# EAGLE design The Yowler v9 (EAGLE 7.3.0)
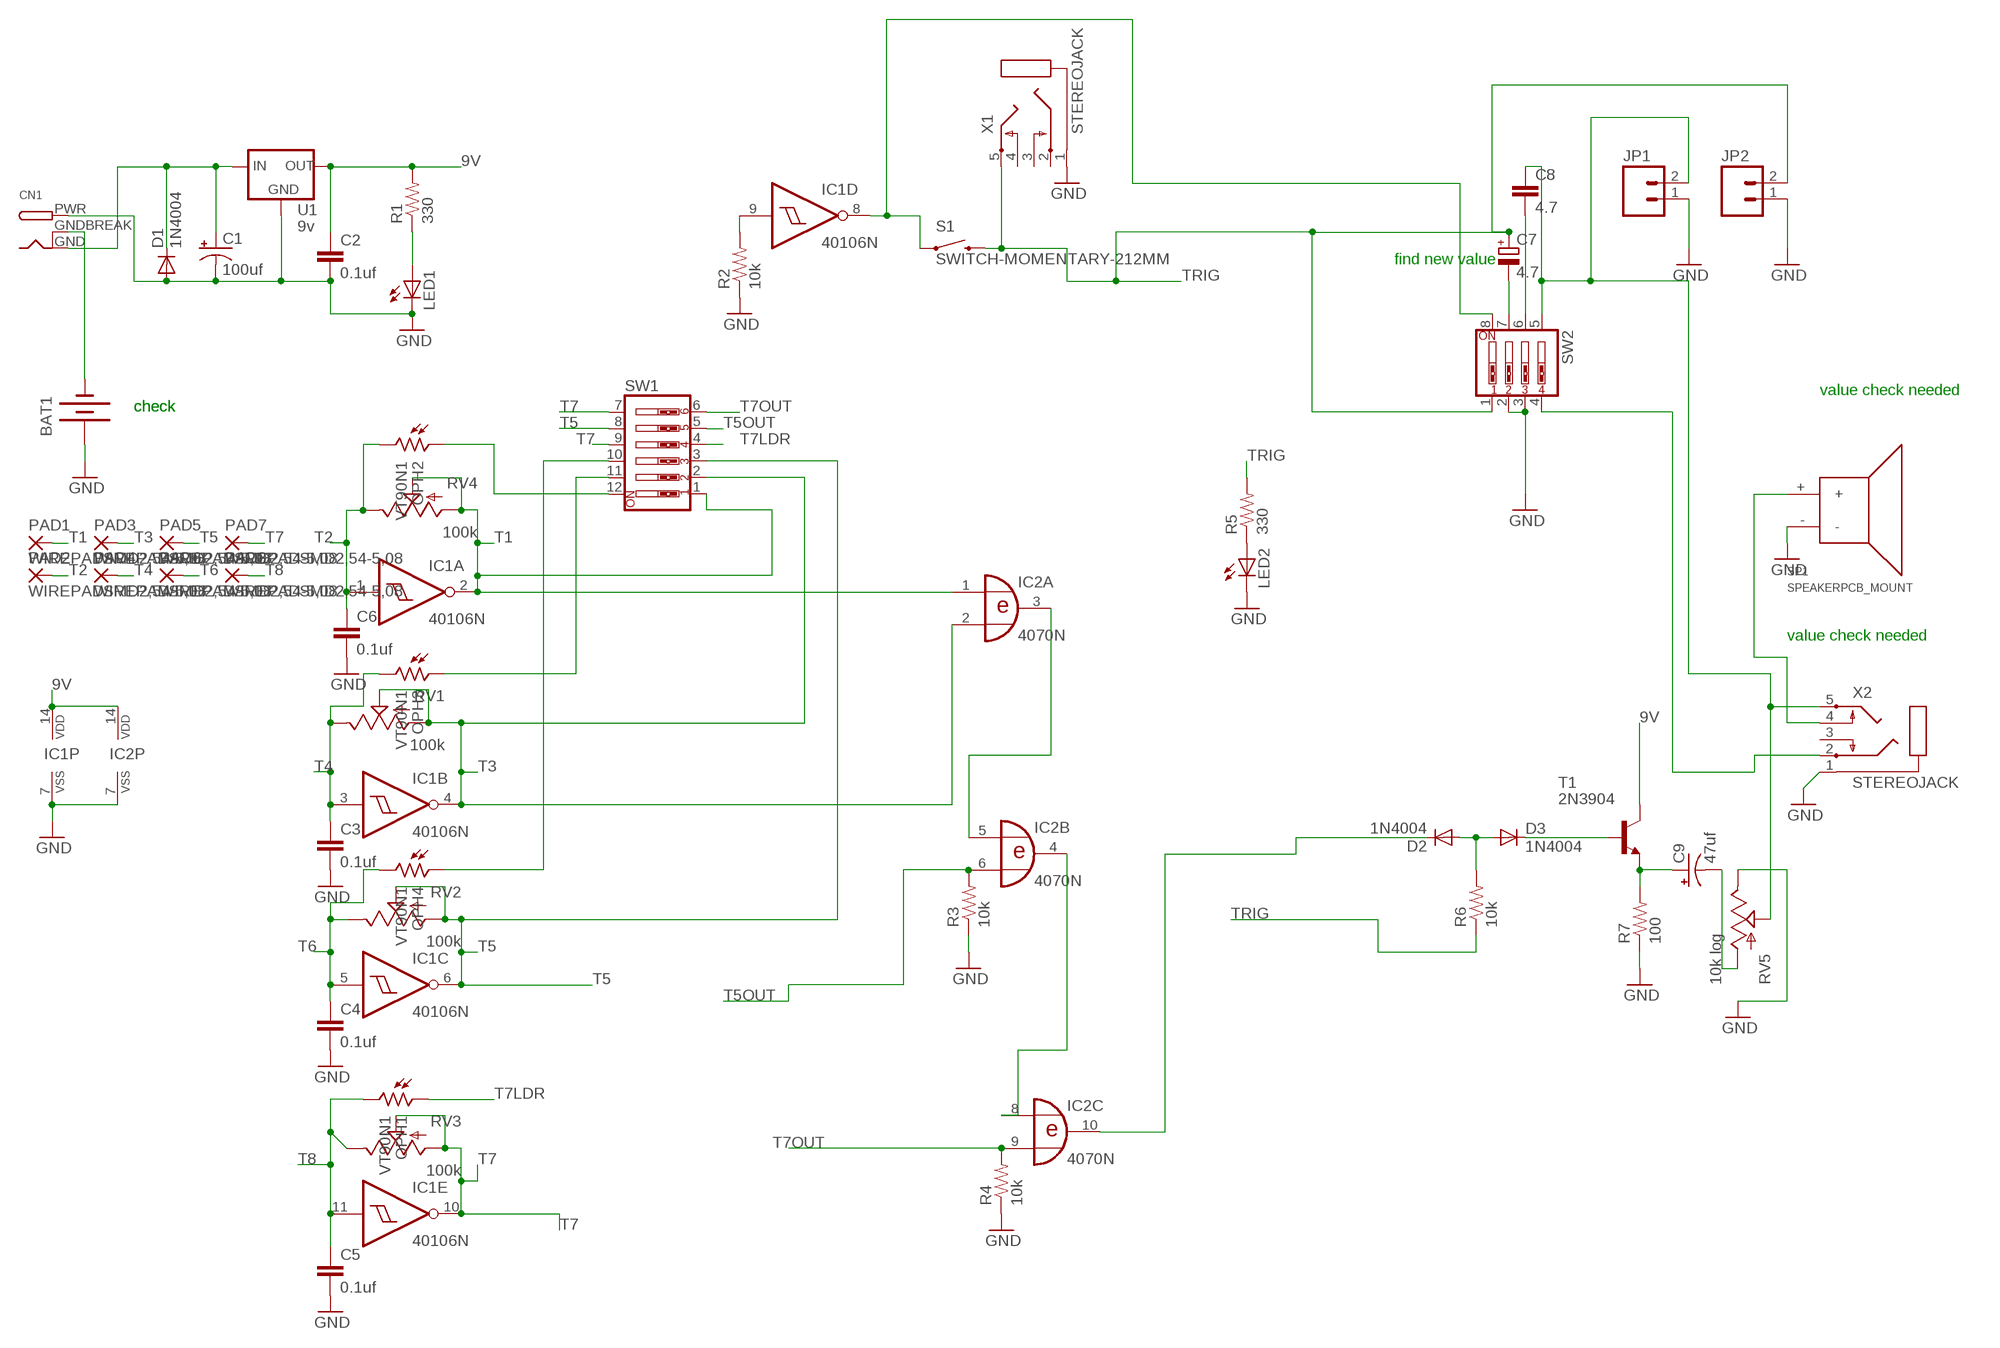
[diagram p0: schematic, sheet 1]

## Parts
BAT1  BATTERY9V  [BATTCON_9V]
C1  100uf  CPOL-USE5-6  [E5-6]
C2  0.1uf  CAPPTH1  [CAP-PTH-5MM]
C3  0.1uf  CAPPTH1  [CAP-PTH-5MM]
C4  0.1uf  CAPPTH1  [CAP-PTH-5MM]
C5  0.1uf  CAPPTH1  [CAP-PTH-5MM]
C6  0.1uf  CAPPTH1  [CAP-PTH-5MM]
C7  4.7  CPOL-EUE5-5  [E5-5]
C8  4.7  C-EU050-030X075  [C050-030X075]
C9  47uf  CAP_POLPTH2  [CPOL-RADIAL-10UF-25V]
CN1  DCBARRELPTH  [DCJACK_2MM_PTH]
D1  1N4004  [DO41-10]
D2  1N4004  [DO41-10]
D3  1N4004  [DO41-10]
IC1  40106N  [DIL14]
IC2  4070N  [DIL14]
JP1  M02POGO_PIN_HOLES_ONLY  [1X02_PP_HOLES_ONLY]
JP2  M02POGO_PIN_HOLES_ONLY  [1X02_PP_HOLES_ONLY]
LED1  LED3MM  [LED3MM]
LED2  LED3MM  [LED3MM]
OPH1  VT90N1  [VT900]
OPH2  VT90N1  [VT900]
OPH3  VT90N1  [VT900]
OPH4  VT90N1  [VT900]
PAD1  WIREPADSMD2,54-5,08  [SMD2,54-5,08]
PAD2  WIREPADSMD2,54-5,08  [SMD2,54-5,08]
PAD3  WIREPADSMD2,54-5,08  [SMD2,54-5,08]
PAD4  WIREPADSMD2,54-5,08  [SMD2,54-5,08]
PAD5  WIREPADSMD2,54-5,08  [SMD2,54-5,08]
PAD6  WIREPADSMD2,54-5,08  [SMD2,54-5,08]
PAD7  WIREPADSMD2,54-5,08  [SMD2,54-5,08]
PAD8  WIREPADSMD2,54-5,08  [SMD2,54-5,08]
R1  330  RESISTORPTH-1/4W  [AXIAL-0.4]
R2  10k  RESISTORPTH-1/4W  [AXIAL-0.4]
R3  10k  RESISTORPTH-1/4W  [AXIAL-0.4]
R4  10k  RESISTORPTH-1/4W  [AXIAL-0.4]
R5  330  RESISTORPTH-1/4W  [AXIAL-0.4]
R6  10k  RESISTORPTH-1/4W  [AXIAL-0.4]
R7  100  RESISTORPTH-1/4W  [AXIAL-0.4]
RV1  100k  POT  [ALPS_POT]
RV2  100k  POT  [ALPS_POT]
RV3  100k  POT  [ALPS_POT]
RV4  100k  POT  [ALPS_POT]
RV5  10k log  POT  [ALPS_POT]
S1  SWITCH-MOMENTARY-212MM  [TACTILE-PTH-12MM]
SP1  SPEAKERPCB_MOUNT  [PCB_MOUNT_SPEAKER]
SW1  SW_DIP-6  [EDG-06]
SW2  SW_DIP-4  [EDG-04]
T1  2N3904  [TO92]
U1  9v  V_REG_78XX-TO-220  [TO-220-ALT]
X1  STEREOJACK  [STX3100]
X2  STEREOJACK  [STX3100]

## Nets
9V: C2.1 IC1.14(P:VDD) IC2.14(P:VDD) R1.P$2 T1.1(C) U1.OUT
AUDIO: SW2.4 X2.2
GND: BAT1.+ C1.- C2.2 C3.2 C4.2 C5.2 C6.2 CN1.PWR D1.A IC1.7(P:VSS) IC2.7(P:VSS) JP1.1 JP2.1 LED1.K(C) LED2.K(C) R2.P$1 R3.P$1 R4.P$1 R7.P$1 RV5.P$1(E) SP1.- SW2.2 SW2.3 U1.GND X1.1 X2.1
N$1: LED2.A R5.P$1
N$2: IC1.9(D:I) R2.P$2
N$3: OPH4.1 SW1.10
N$4: IC2.4(B:O) IC2.8(C:I0)
N$5: C9.2(-) RV5.P$3(A)
N$6: C1.+ CN1.GND D1.C U1.IN
N$7: LED1.A R1.P$1
N$11: IC2.3(A:O) IC2.5(B:I0)
N$12: OPH2.1 SW1.12
N$13: IC1.8(D:O) S1.1 SW2.8
N$14: OPH3.1 SW1.11
N$16: BAT1.- CN1.GNDBREAK
N$17: C8.2 SW2.6
N$18: D2.C IC2.10(C:O)
N$19: D2.A D3.A R6.P$2
N$20: C7.- SW2.7
N$22: D3.C T1.2(B)
N$23: C9.1(+) R7.P$2 T1.3(E)
N$25: C8.1 JP1.2 RV5.P$2(S) SW2.5 X2.5
N$26: SP1.+ X2.4
T1: IC1.2(A:O) IC2.1(A:I0) PAD1.1(P) RV4.P$2(S) RV4.P$3(A) SW1.1
T2: C6.1 IC1.1(A:I) OPH2.2 PAD2.1(P) RV4.P$1(E)
T3: IC1.4(B:O) IC2.2(A:I1) PAD3.1(P) RV1.P$2(S) RV1.P$3(A) SW1.2
T4: C3.1 IC1.3(B:I) OPH3.2 PAD4.1(P) RV1.P$1(E)
T5: IC1.6(C:O) PAD5.1(P) RV2.P$2(S) RV2.P$3(A) SW1.3 SW1.8
T5OUT: IC2.6(B:I1) R3.P$2 SW1.5
T6: C4.1 IC1.5(C:I) OPH4.2 PAD6.1(P) RV2.P$1(E)
T7: IC1.10(E:O) PAD7.1(P) RV3.P$2(S) RV3.P$3(A) SW1.7 SW1.9
T7LDR: OPH1.1 SW1.4
T7OUT: IC2.9(C:I1) R4.P$2 SW1.6
T8: C5.1 IC1.11(E:I) OPH1.2 PAD8.1(P) RV3.P$1(E)
TRIG: C7.+ JP2.2 R5.P$2 R6.P$1 S1.3 SW2.1 X1.5
Unconnected: IC1.12(F:O) IC1.13(F:I) IC2.11(D:O) IC2.12(D:I0) IC2.13(D:I1) X1.2 X1.3 X1.4 X2.3

## Notes on the sheet
- find new value
- value check needed
- check | check
- value check needed

## Library data of the parts
BAT1 = SparkFun-Electromechanical:BATTERY: Battery Holders Various common sizes : AA, AAA, 18650 (PRT-12895), 20mm coin cell and 12mm coin cell. 20MM_4LEGS, BATT-10373
C1 = adafruit:CPOL-US: POLARIZED CAPACITOR, American symbol
C2-C6 = SparkFun-Passives:CAP: Capacitor Standard 0603 ceramic capacitor, and 0.1" leaded capacitor.
C7 = resistor:CPOL-EU: POLARIZED CAPACITOR, European symbol
C8 = resistor:C-EU: CAPACITOR, European symbol
C9 = SparkFun-Capacitors:CAP_POL: Capacitor Polarized These are standard SMD and PTH capacitors. Normally 10uF, 47uF, and 100uF in electrolytic and tantalum varieties. Always verify the external diameter of the through hole cap, it varies with capacity, voltage, and manufacturer. The EIA devices should be standard.
CN1 = adafruit:DCBARREL: 2.0mm DC Barrel Jack DCJACK_2MM_PTH - Through Hole Jack (4UConnector: 05537)
D1-D3 = adafruit:1N4004: DIODE General purpose 1N400x type rectifier (With bigger pads) http://www.ladyada.net/library/pcb/eaglelibrary.html
IC1 = 40xx:40106: Hex SCHMITT TRIGGER
IC2 = 40xx:4070: Quad 2-input XOR
JP1 JP2 = SparkFun-Connectors:M02: Standard 2-pin 0.1" header. Use with - straight break away headers ( PRT-00116) - right angle break away headers (PRT-00553) - swiss pins (PRT-00743) - machine pins (PRT-00117) - female headers (PRT-00115) Molex polarized connector foot print use with: PRT-08233 with associated crimp pins and housings. 2.54_SCREWTERM for use with PRT-10571. 3.5mm Screw Terminal footprints for PRT-08084 5mm Screw Terminal footprints for use with PRT-08432
LED1 LED2 = adafruit:LED: LED OSRAM: - CHIPLED LG R971, LG N971, LY N971, LG Q971, LY Q971, LO R971, LY R971 LH N974, LH R974 LS Q976, LO Q976, LY Q976 LO Q996 - Hyper CHIPLED LW Q18S LB Q993, LB Q99A, LB R99A - SideLED LS A670, LO A670, LY A670, LG A670, LP A670 LB A673, LV A673, LT A673, LW A673 LH A674 LY A675 LS A676, LA A676, LO A676, LY A676, LW A676 LS A679, LY A679, LG A679 - Hyper Micro SIDELED® LS Y876, LA Y876, LO Y876, LY Y876 LT Y87S - SmartLED LW L88C, LW L88S LB L89C, LB L89S, LG L890 LS L89K, LO L89K, LY L89K LS L896, LA L896, LO L896, LY L896 - TOPLED LS T670, LO T670, LY T670, LG T670, LP T670 LSG T670, LSP T670, LSY T670, LOP T670, LYG T670 LG T671, LOG T671, LSG T671 LB T673, LV T673, LT T673, LW T673 LH T674 LS T676, LA T676, LO T676, LY T676, LB T676, LH T676, LSB T676, LW T676 LB T67C, LV T67C, LT T67C, LS T67K, LO T67K, LY T67K, LW E67C LS E67B, LA E67B, LO E67B, LY E67B, LB E67C, LV E67C, LT E67C LW T67C LS T679, LY T679, LG T679 LS T770, LO T770, LY T770, LG T770, LP T770 LB T773, LV T773, LT T773, LW T773 LH T774 LS E675, LA E675, LY E675, LS T675 LS T776, LA T776, LO T776, LY T776, LB T776 LHGB T686 LT T68C, LB T68C - Hyper Mini TOPLED® LB M676 - Mini TOPLED Santana® LG M470 LS M47K, LO M47K, LY M47K Source: http://www.osram.convergy.de/
OPH1-OPH4 = photo-elements:VT9: Photoconductive Cell VT900 Series Source: http://optoelectronics.perkinelmer.com/content/Datasheets/DTS_vt900seriesdatasheet.pdf
PAD1-PAD8 = wirepad:WIREPAD: Wire PAD connect wire on PCB
R1-R7 = SparkFun-Passives:RESISTOR: Resistor Basic schematic elements and footprints for 0603, 1206, and PTH resistors.
RV1-RV5 = SparkFun-Electromechanical:POT; PROD_ID: RES-09177
S1 = SparkFun-Electromechanical:SWITCH-MOMENTARY-2: Various NO switches- pushbuttons, reed, etc; PROD_ID: SWCH-09185
SP1 = SparkFun-Electromechanical:SPEAKER: General speakers.; MFG: SANCO; PROD_#: NA; SKU: COM-11089; SPARKLE_ID: 6504
SW1 = special:SW_DIP-6: DIP SWITCH
SW2 = special:SW_DIP-4: DIP SWITCH
T1 = transistor:2N3904: NPN TRANSISTOR
U1 = SparkFun-PowerIC:V_REG_78XX: Voltage Regulator Standard 78xx regulator. IGO (Input Ground Output). Spark Fun Electronics SKU : COM-00107; PROD_ID: VREG-08450; SF_ID: COM-00107
X1 X2 = adafruit:STEREOJACK: MIC/HEADPHONE JACK Stereo jack with two switches. Kycon STX3100, CUI SJ1-3555NG and/or 4UCon 05544

## Board
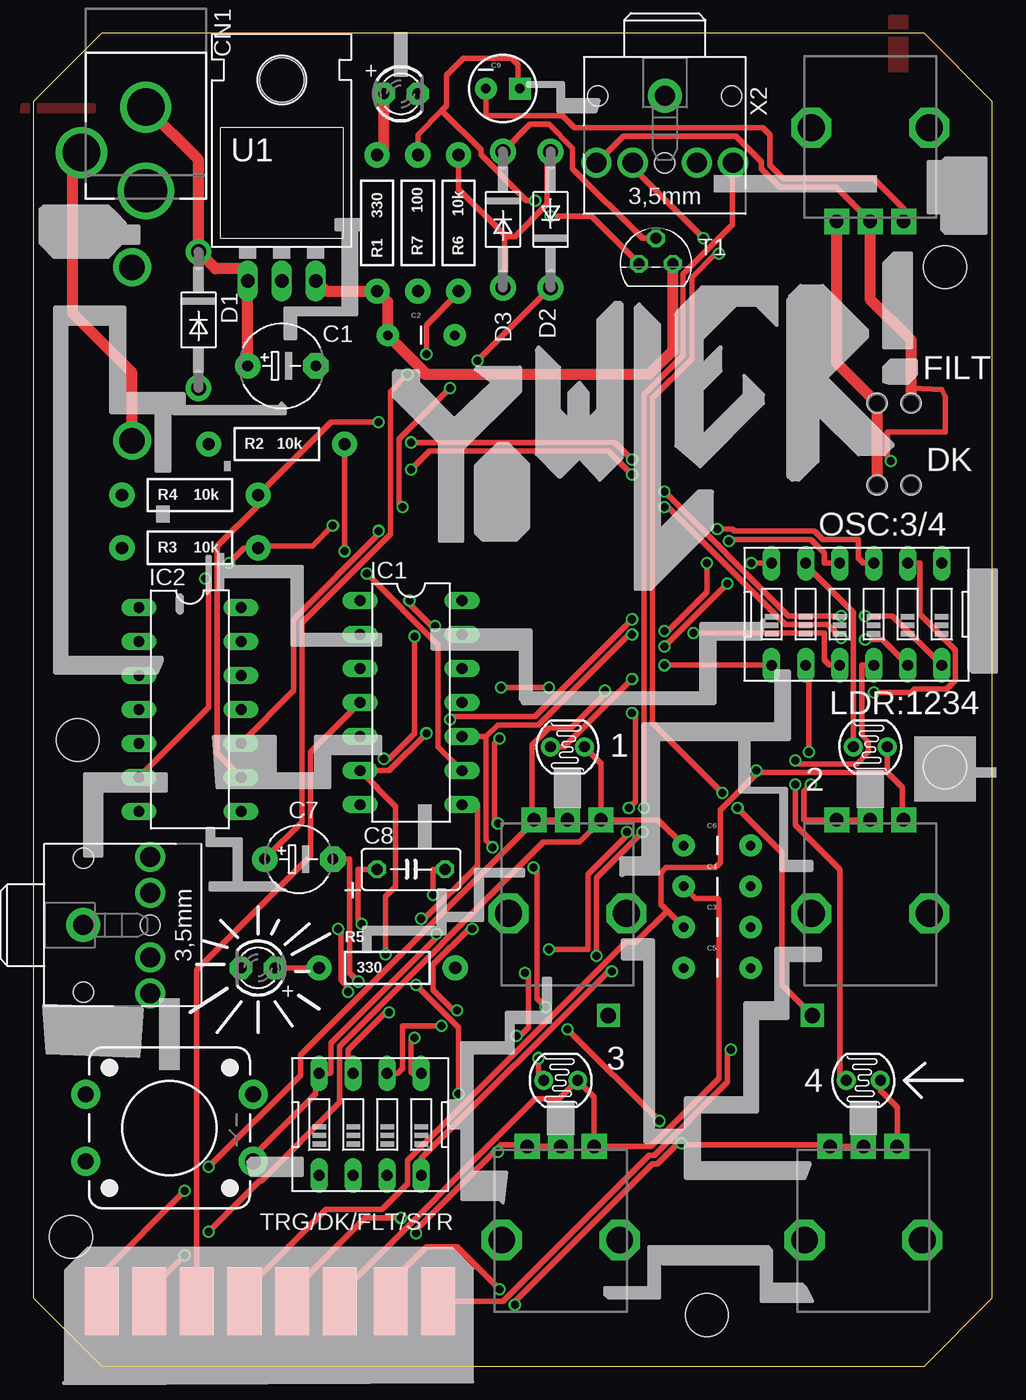
[diagram p1: board, top side]
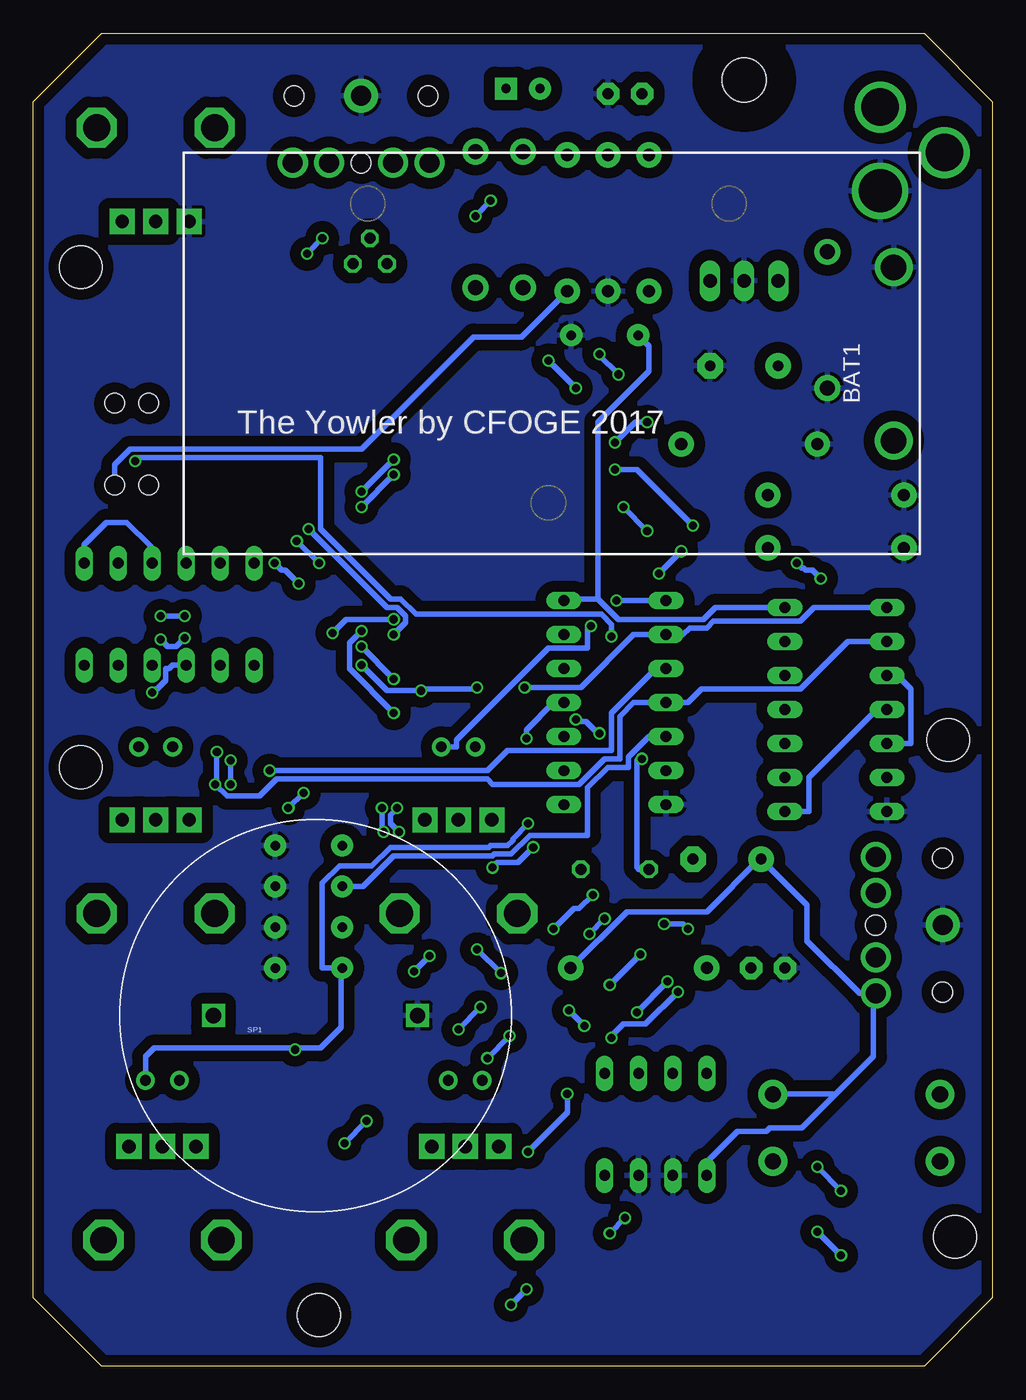
[diagram p2: board, bottom side, seen from below]

Size 71.61 x 99.49 mm. Coordinates in mm from the lower left corner, seen from the top.
Outline: 0,94.41 0,5.08 5.08,0 66.53,0 71.61,5.08 71.61,94.41 66.53,99.49 5.08,99.49 0,94.41
Copper layers (1*16): Top 0.035mm / dielectric 1.5mm / Bottom 0.035mm
Design rules "SeeedStudio_2layer_DRU_no_angle_20140221": minimum track width 6mil, minimum drill 12mil, track to track 6mil, track to pad 6mil, pad to pad 6mil, via to via 6mil, smd to smd 0mil, copper to edge 10mil, drill to drill 10mil, minimum pad ring 10mil, minimum via ring 6mil, stop-mask expansion 2mil, vias tented up to drill 100mil, thermal gap 10mil
Holes 3.2 mm at 3.3,46.74 50.29,3.81 68.07,82.04 2.79,9.65 68.07,44.7

### Footprints (pad centres in the part's own frame; a part is rotated, then mirrored left to right if it is on the bottom)
BATTCON_9V = drill 1.905: + 0,0; - 0,-12.954
E5-6 = drill 0.813 pad 1.905: + -2.54,0 | drill 0.813 pad 1.905 octagon: - 2.54,0
CAP-PTH-5MM = drill 0.7 pad 1.651: 1 -2.5,0; 2 2.5,0
E5-5 = drill 0.813 pad 1.905: + -2.54,0 | drill 0.813 pad 1.905 octagon: - 2.54,0
C050-030X075 = drill 0.813 octagon: 1 -2.54,0; 2 2.54,0
CPOL-RADIAL-10UF-25V = drill 0.7 pad 1.651 square: 1 1.27,0 | drill 0.7 pad 1.651: 2 -1.27,0
DCJACK_2MM_PTH = drill 2.8: GND 0,7.35; GNDBREAK 4.8,10.75 | drill 3.2: PWR 0,13.6
DO41-10 = drill 1.118 pad 1.93: A 5.08,0; C -5.08,0
DIL14 = drill 0.813 long: 1 -7.62,-3.81; 2 -5.08,-3.81; 3 -2.54,-3.81; 4 0,-3.81; 5 2.54,-3.81; 6 5.08,-3.81; 7 7.62,-3.81; 8 7.62,3.81; 9 5.08,3.81; 10 2.54,3.81; 11 0,3.81; 12 -2.54,3.81; 13 -5.08,3.81; 14 -7.62,3.81
1X02_PP_HOLES_ONLY = drill 0.889 pad 0.813: 1 0,0; 2 2.54,0 | hole 1.473: 0,0; 2.54,0
LED3MM = drill 0.813 pad 1.676 octagon: A -1.27,0; K 1.27,0
VT900 = drill 0.8 pad 1.4: 1 -1.27,0; 2 1.27,0
SMD2,54-5,08 = smd 2.54 x 5.08: 1 0,0
AXIAL-0.4 = drill 0.9 pad 1.88: P$1 -5.08,0; P$2 5.08,0
ALPS_POT = drill 1 pad 1.88 square: P$1 7,-2.5; P$2 7,0; P$3 7,2.5 | drill 2 octagon: P$4 0,-4.4; P$5 0,4.4
TACTILE-PTH-12MM = drill 1.2 pad 2.159: 1 6.25,-2.5; 2 -6.25,-2.5; 3 6.25,2.5; 4 -6.25,2.5
PCB_MOUNT_SPEAKER = drill 1.143 square: + -7.62,0; - 7.62,0
EDG-06 = drill 0.813 long: 1 -6.35,-3.81; 2 -3.81,-3.81; 3 -1.27,-3.81; 4 1.27,-3.81; 5 3.81,-3.81; 6 6.35,-3.81; 7 6.35,3.81; 8 3.81,3.81; 9 1.27,3.81; 10 -1.27,3.81; 11 -3.81,3.81; 12 -6.35,3.81
EDG-04 = drill 0.813 long: 1 -3.81,-3.81; 2 -1.27,-3.81; 3 1.27,-3.81; 4 3.81,-3.81; 5 3.81,3.81; 6 1.27,3.81; 7 -1.27,3.81; 8 -3.81,3.81
TO92 = drill 0.813 octagon: 1 1.27,0; 2 0,1.905; 3 -1.27,0
TO-220-ALT = drill 1.016 long: GND 0,-3.81; IN -2.54,-3.81; OUT 2.54,-3.81 | hole 3.302: 0,11.176
STX3100 = drill 1.5 pad 2.54: 1 2.7,-0.1 | drill 1.5: 2 7.7,5; 3 7.7,2.3; 4 7.7,-2.5; 5 7.7,-5.2 | hole 1.5: 2.7,4.9; 2.7,-5.1; 7.7,-0.1

### Placement (x,y rotation side)
BAT1  7.37,82.04 0 bottom
C1  18.54,74.68 0 top
C2  28.96,76.96 0 top
C3  51.05,32.77 0 top
C4  51.05,35.81 0 top
C5  51.05,29.72 0 top
C6  51.05,38.86 0 top
C7  19.81,37.85 0 top
C8  28.19,37.08 0 top
C9  35.05,95.38 0 top
CN1  8.38,101.35 180 top
D1  12.32,78.11 270 top
D2  38.61,85.6 90 top
D3  35.05,85.6 270 top
IC1  28.19,49.53 270 top
IC2  11.68,49.02 270 top
JP1  62.99,71.88 0 top
JP2  62.99,65.79 0 top
LED1  27.43,95 0 top
LED2  16.76,29.72 180 top
OPH1  61.98,21.34 0 top
OPH2  39.88,46.23 0 top
OPH3  62.48,46.23 0 top
OPH4  39.37,21.34 0 top
PAD1  5.08,4.83 180 top
PAD2  8.64,4.83 180 top
PAD3  12.19,4.83 180 top
PAD4  15.75,4.83 180 top
PAD5  19.3,4.83 180 top
PAD6  22.86,4.83 180 top
PAD7  26.67,4.83 0 top
PAD8  30.23,4.83 0 top
R1  25.65,85.34 270 top
R2  18.16,68.83 0 top
R3  11.68,61.09 0 top
R4  11.68,65.02 0 top
R5  26.42,29.72 0 top
R6  31.75,85.34 90 top
R7  28.7,85.34 90 top
RV1  62.48,33.78 90 top
RV2  39.37,9.4 90 top
RV3  61.98,9.4 90 top
RV4  39.88,33.78 90 top
RV5  62.48,92.46 270 top
S1  10.16,17.78 0 top
SP1  50.55,26.16 0 bottom
SW1  61.47,56.13 0 top
SW2  25.15,18.03 0 top
T1  46.48,82.3 0 top
U1  18.54,84.84 0 top
X1  1.02,33.02 0 top
X2  47.24,97.54 270 top

### Tracks (layer width: path | path; a pad name or v marks a point on that pad's centre or on a via)
9V
  Top 0.813: U1.OUT 21.84,80.26 R1.P$2 26.46,79.46 C2.1 29.21,74.21 29.21,74.04 45.97,74.04 47.75,75.82 T1.1
  Bottom 0.406: IC2.14 20.7,56.64 21.59,55.75 27.94,55.75 29.46,57.28 | 29.46,57.28 31.88,57.28 IC1.14 | 29.46,57.28 29.46,70.48 25.65,74.3 25.65,76.16 C2.1
AUDIO  (via drill 0.6)
  Top 0.406: SW2.4 28.96,15.49 42.93,29.46 v43.18,29.46 | v42.04,30.61 42.04,36.45 v45.47,39.88 | v45.59,41.66 45.59,72.52 48.51,75.44 48.51,81.53 52.2,85.22 52.2,89.79 X2.2
  Bottom 0.406: v42.04,30.61 v43.18,29.46 | v45.47,39.88 45.59,40.01 v45.59,41.66
GND
  Top 0.813: RV5.P$1 59.98,74.89 JP1.1 JP2.1
  pour Bottom (isolate 0.813): -3.3,102.62 74.8,102.62 74.8,-3.17 -7.49,-4.06 -3.3,102.23
N$1
  Top 0.406: LED2.A R5.P$1
N$2  (via drill 0.6)
  Top 0.406: v23.24,60.83 R2.P$2 | v24.89,59.18 30.23,53.85 30.23,46.23 IC1.9
  Bottom 0.406: v24.89,59.18 v23.24,60.83
N$3  (via drill 0.6)
  Top 0.406: SW1.10 59.05,59.94 59.05,60.71 58.04,61.72 51.82,61.72 v51.94,61.59 | v50.29,59.94 50.29,57.78 47.37,54.86 v47.12,54.86 | v44.7,48.77 44.96,48.51 44.96,42.16 v44.45,41.66 | v44.32,39.88 44.32,39.62 41.4,36.7 41.4,31.12 v38.48,31.12 | v36.7,29.34 36.96,29.08 36.96,25.27 36.32,24.64 v36.07,24.64 | v37.72,22.99 37.72,21.34 OPH4.1
  Bottom 0.406: v50.29,59.94 v51.94,61.59 | v47.12,54.86 48.01,53.98 48.01,52.07 v44.7,48.77 | v44.45,41.66 44.96,41.15 44.96,40.51 v44.32,39.88 | v36.7,29.34 v38.48,31.12 | v37.72,22.99 v36.07,24.64
N$4
  Bottom 0.406: IC2.4 8.64,49.02 13.72,43.94 13.72,41.4 IC2.8
N$5
  Top 0.406: C9.2 33.78,93.34 39.5,93.34 40.39,92.46 54.48,92.46 54.99,91.95 54.99,89.66 56.01,88.65 62.74,88.65 64.98,86.4 RV5.P$3
N$6
  Top 0.813: C1.+ U1.IN 16,81.91 13.59,81.91 D1.C 12.32,90.06 CN1.GND
N$7
  Top 0.813: R1.P$1 26.16,90.93 LED1.A
N$8
  pour Top: 64.01,100.71 64.01,96.77 65.15,96.77 65.15,100.71
N$9
  pour Top: -0.89,93.73 4.45,93.73 4.45,94.11 -0.76,94.11 -0.76,93.85
N$11
  Bottom 0.406: IC2.3 7.11,51.56 6.1,50.55 6.1,46.48 IC2.5
N$12  (via drill 0.6)
  Top 0.406: v53.59,59.94 SW1.12 | v47.12,53.72 v51.82,58.42 | v44.7,51.31 39.62,46.23 OPH2.1
  Bottom 0.406: v53.59,59.94 53.09,59.44 52.83,59.44 v51.82,58.42 | v44.7,51.31 v47.12,53.72
N$13  (via drill 0.6)
  Top 0.406: S1.1 16.41,15.65 21.08,20.32 21.08,21.59 SW2.8 22.1,21.84 22.23,21.97 22.23,24.13 30.1,32 v30.1,32.26 | v28.96,33.4 29.21,33.4 33.15,37.34 33.15,41.91 IC1.8
  Bottom 0.406: v28.96,33.4 v30.1,32.26
N$14
  Top 0.406: OPH3.1 61.21,56.26 57.66,59.82 SW1.11
N$16
  Top 0.813: BAT1.- 7.37,74.17 2.92,78.61 2.92,90.8 3.13,90.6 CN1.GNDBREAK
N$17  (via drill 0.6)
  Top 0.406: SW2.6 27.18,21.84 27.56,22.22 27.56,25.4 v30.48,25.4 | v31.62,26.54 31.37,26.54 29.84,28.07 29.84,29.97 32.51,32.64 v32.77,32.64 | v29.84,35.18 29.84,37.08 C8.2
  Bottom 0.406: v31.62,26.54 v30.48,25.4 | v32.77,32.64 31.24,34.16 30.86,34.16 v29.84,35.18
N$18  (via drill 0.6)
  Top 0.406: v33.15,75.06 D2.C | v31.12,73.03 27.3,69.22 27.3,64.39 v27.56,64.14 | v25.78,62.36 25.78,62.1 19.43,55.75 19.43,50.42 IC2.10
  Bottom 0.406: v31.12,73.03 v33.15,75.06 | v25.78,62.36 v27.56,64.14
N$19
  Top 0.406: D3.A 35.18,80.64 35.18,84.33 | 35.18,84.33 35.18,84.45 31.75,87.88 R6.P$2 | D2.A 38.35,90.42 38.35,86.74 35.94,84.33 35.18,84.33
N$20  (via drill 0.6)
  Top 0.406: SW2.7 23.5,21.84 23.5,23.62 26.29,26.42 v26.54,26.42 | v24.26,28.7 23.62,29.34 23.62,37.85 C7.-
  Bottom 0.406: v24.26,28.7 v26.54,26.42
N$22
  Top 0.406: T1.2 45.47,84.2 40.26,89.41 40.26,90.93 38.48,92.71 37.08,92.71 D3.C
N$23  (via drill 0.6)
  Top 0.406: C9.1 36.2,95.5 36.2,97.16 35.69,97.66 32.13,97.66 30.86,96.39 30.86,94.11 30.48,93.73 | 30.48,93.73 28.7,91.95 R7.P$2 | 30.48,93.73 33.4,90.8 33.4,90.42 36.83,87 v37.47,87 | v38.61,85.85 41.66,85.85 T1.3
  Bottom 0.406: v38.61,85.85 v37.47,87
N$25  (via drill 0.6)
  Top 0.406: X2.5 42.16,89.92 44.07,91.82 52.45,91.82 54.36,89.92 54.36,89.41 55.75,88.01 59.94,88.01 62.23,85.72 RV5.P$2 | SW2.5 28.32,21.84 28.19,21.97 28.19,24.51 v28.45,24.51 | v23.5,27.94 23.5,28.32 22.99,28.83 22.99,32.64 v22.73,32.64 | v24.51,33.02 24.26,33.27 24.26,37.08 C8.1 | v26.16,45.34 26.54,45.34 28.45,47.24 v28.45,54.48 | v64.01,67.56 63.75,67.82 63.75,69.72 68.07,69.72 68.07,72.39 67.82,72.9 65.53,73.03
  Top 0.813: JP1.2 65.53,73.03 65.53,76.58 62.48,79.63 RV5.P$2
  Bottom 0.406: v28.45,24.51 28.45,24.64 27.56,25.53 25.91,25.53 v23.5,27.94 | v22.73,32.64 23.11,33.02 v24.51,33.02 | C8.1 26.42,37.08 26.54,37.21 26.54,45.21 26.42,45.34 v26.16,45.34 | v28.45,54.48 28.45,55.37 29.21,56.13 43.05,56.13 44.2,57.28 44.96,57.28 50.16,62.48 50.16,67.82 63.75,67.82 v64.01,67.56
N$26  (via drill 0.6)
  Top 0.406: v50.04,84.2 44.83,89.41 44.83,89.79 X2.4 | v51.18,83.06 50.93,83.06 49.15,81.28 49.15,75.18 46.23,72.26 46.23,48.01 v51.44,42.8 | v52.58,41.66 55.88,38.35 55.88,28.45 SP1.+
  Bottom 0.406: v51.18,83.06 v50.04,84.2 | v52.58,41.66 v51.44,42.8
T1  (via drill 0.6)
  Top 0.406: RV4.P$3 RV4.P$2 | PAD1.1 5.08,6.86 v11.3,13.08 | v13.08,14.86 19.94,21.72 19.94,23.24 37.34,40.64 RV4.P$3 | v47.12,52.32 SW1.1 | v42.67,50.42 42.67,50.16 40.13,47.62 38.48,47.62 37.21,46.35 37.21,40.89 RV4.P$3 | v38.48,50.67 v34.92,50.67
  Bottom 0.406: v13.08,14.86 v11.3,13.08 | v47.12,52.32 45.21,50.42 v42.67,50.42 42.55,50.55 38.61,50.55 v38.48,50.67 | IC2.1 13.34,56.64 14.35,55.63 20.83,55.63 21.34,55.12 22.61,55.12 23.11,54.61 IC1.2 26.8,54.61 30.73,50.67 v34.92,50.67
T2  (via drill 0.6)
  Top 0.406: C6.1 46.63,40.78 RV4.P$1 | OPH2.2 42.38,45 RV4.P$1 | PAD2.1 8.64,5.59 v11.3,8.25 | v13.08,10.03 16.89,13.84 17.02,13.84 22.86,19.68 22.86,23.88 38.1,39.12 40.77,39.12 42.29,40.64 RV4.P$1 | v28.07,57.15 28.07,56.9 29.72,55.24 v29.97,55.24
  Bottom 0.406: v13.08,10.03 v11.3,8.25 | v28.07,57.15 IC1.1 | v29.97,55.24 30.23,54.99 30.23,53.59 33.15,53.59 40.01,46.74 40.01,46.23 OPH2.2
T3  (via drill 0.6)
  Top 0.406: RV1.P$2 RV1.P$3 59.82,40.77 57.53,40.77 57.53,42.93 v58.04,43.43 | PAD3.1 12.19,29.59 20.7,38.1 20.7,45.85 IC1.4 | SW1.2 57.91,52.32 v57.91,45.85
  Bottom 0.406: v57.91,45.85 57.91,43.56 v58.04,43.43 57.15,42.55 54.74,42.55 53.47,43.81 37.72,43.81 37.34,43.43 30.86,43.43 28.96,45.34 27.81,45.34 27.81,48.51 26.8,49.53 IC1.4 22.73,49.53 21.72,50.55 14.35,50.55 10.79,54.1 IC2.2
T4  (via drill 0.6)
  Top 0.406: RV1.P$1 64.9,40.87 64.9,43.18 63.75,44.32 | 63.75,44.32 OPH3.2 | C3.1 47.33,33.99 | 47.33,33.99 46.86,34.46 46.86,36.83 47.24,37.21 50.93,37.21 51.31,37.59 51.31,41.53 54.1,44.32 | 54.1,44.32 63.75,44.32 | PAD4.1 15.75,5.59 21.84,11.68 26.04,11.68 27.94,13.59 27.94,15.37 44.2,31.62 44.96,31.62 47.33,33.99 | v53.98,44.45 54.1,44.32
  Bottom 0.406: IC1.3 25.15,52.07 28.45,48.77 28.45,45.97 36.2,45.97 37.72,44.45 v53.98,44.45
T5  (via drill 0.6)
  Top 0.406: RV2.P$2 RV2.P$3 36.7,16.51 34.92,16.51 34.54,16.13 | PAD5.1 19.3,5.59 24.77,11.05 v27.43,11.05 | v28.57,9.91 28.57,10.16 34.54,16.13 | v31.75,20.32 31.75,25.27 v28.57,28.45 | v26.29,30.73 26.29,35.05 27.05,35.81 27.05,41.78 IC1.6 26.54,44.45 v29.34,47.24 | v34.67,16 34.54,16.13 | v62.74,50.29 65.53,50.29 65.79,50.55 68.2,50.55 68.83,51.18 68.83,53.47 66.17,56.13 66.17,59.94 SW1.8 | SW1.3 59.44,52.32 59.05,52.7 59.05,54.74 v49.28,54.74 | v44.7,55.75 37.47,48.51 31.37,48.51 v31.12,48.26
  Bottom 0.406: v28.57,9.91 v27.43,11.05 | v34.67,16 31.75,18.92 v31.75,20.32 | v26.29,30.73 v28.57,28.45 | v62.74,50.29 62.48,50.55 62.36,50.55 61.72,51.18 61.72,52.07 61.47,52.07 61.21,52.32 SW1.3 | v49.28,54.74 48.26,55.75 v44.7,55.75 | v31.12,48.26 30.99,48.13 30.35,48.13 29.46,47.24 v29.34,47.24
T5OUT  (via drill 0.6)
  Top 0.406: v14.61,59.94 15.75,61.09 R3.P$2 16.89,61.21 20.83,61.21 v22.35,62.74 | v12.83,58.8 13.08,58.55 13.08,49.15 IC2.6 | v28.19,66.93 29.59,68.33 42.93,68.33 v44.7,66.55 | v47.12,64.14 47.37,64.14 56.13,55.37 59.31,55.37 v60.33,54.36 | v62.1,54.23 63.37,54.23 SW1.5
  Bottom 0.406: v14.61,59.94 14.22,59.56 14.1,59.56 13.97,59.44 13.46,59.44 v12.83,58.8 | v22.35,62.74 26.54,66.93 v28.19,66.93 | v47.12,64.14 v44.7,66.55 | v60.33,54.36 60.96,53.72 61.59,53.72 v62.1,54.23
T6
  Top 0.406: C4.1 49.44,34.92 51.05,34.92 51.18,34.8 51.18,21.46 46.12,16.4 RV2.P$1 41.87,20.11 OPH4.2 39.24,19.94 37.47,19.94 22.86,5.33 PAD6.1
  Bottom 0.406: IC1.5 25.65,46.99 27.18,45.47 27.18,44.7 28.7,44.7 30.23,43.18 30.23,39.62 34.54,39.62 35.94,38.23 37.21,38.23 37.34,38.1 44.7,38.1 46.99,35.81 C4.1
T7  (via drill 0.6)
  Top 0.406: RV3.P$2 RV3.P$3 59.31,16.51 48.39,16.51 | PAD7.1 26.67,6.22 29.34,8.89 31.62,8.89 v34.8,5.71 | v35.94,4.57 35.94,4.83 46.23,15.11 46.61,15.11 48.01,16.51 48.39,16.51 | v39.88,25.15 v46.74,18.29 | v38.23,26.8 37.59,27.43 37.59,37.21 v37.34,37.21 | v34.29,38.73 33.78,39.24 33.78,46.99 | IC1.10 33.78,46.99 | v48.39,16.64 48.39,16.51 | SW1.9 61.98,59.94 61.59,60.32 61.59,61.72 58.93,61.72 58.29,62.36 52.32,62.36 52.2,62.48 v51.05,62.48 | v44.7,54.61 44.45,54.61 37.72,47.88 34.67,47.88 33.78,46.99
  Bottom 0.406: v35.94,4.57 v34.8,5.71 | SW1.7 67.82,61.34 66.17,62.99 64.64,62.99 62.87,61.21 62.87,60.07 SW1.9 | v46.74,18.29 v48.39,16.64 | v38.23,26.8 v39.88,25.15 | v37.34,37.21 36.96,37.59 35.43,37.59 v34.29,38.73 | v51.05,62.48 45.21,56.64 44.45,56.64 43.81,56.01 43.81,55.5 v44.7,54.61
T7LDR  (via drill 0.6)
  Top 0.406: OPH1.1 60.2,21.34 60.2,37.08 56.9,40.39 v56.9,43.43 | v56.9,45.21 57.15,44.96 61.47,44.96 62.36,45.85 62.36,46.61 61.85,47.12 61.85,52.32 SW1.4
  Bottom 0.406: v56.9,45.21 v56.9,43.43
T7OUT  (via drill 0.6)
  Top 0.406: IC2.9 13.72,45.72 13.72,61.21 16.76,64.26 R4.P$2 22.23,70.48 v25.78,70.48 | v28.19,68.96 43.43,68.96 v44.7,67.69 | v47.12,65.28 56.39,56.01 v60.33,56.01 | v62.1,56.01 64.13,56.01 SW1.6
  Bottom 0.406: v25.78,70.48 26.67,70.48 v28.19,68.96 | v47.12,65.28 v44.7,67.69 | v62.1,56.01 v60.33,56.01
T8  (via drill 0.6)
  Top 0.406: RV3.P$1 64.52,16.44 64.52,19.3 63.25,20.57 OPH1.2 | PAD8.1 35.05,4.83 45.97,15.75 46.36,15.75 51.82,21.21 51.82,23.37 v52.07,23.62 | v34.8,46.86 34.42,46.48 34.42,40.51 v34.67,40.51
  Bottom 0.406: 52.07,23.75 50.16,23.75 48.64,25.27 48.64,29.63 C5.1 50.04,29.72 50.04,36.07 48.77,37.34 46.36,37.34 44.96,38.73 37.59,38.73 37.47,38.86 36.2,38.86 35.81,39.24 35.81,39.37 v34.67,40.51 | 52.07,23.75 62.61,23.75 63.25,23.11 OPH1.2 | v52.07,23.62 52.07,23.75 | IC1.11 32.77,49.53 34.8,47.5 v34.8,46.86
TRIG  (via drill 0.6)
  Top 0.406: v27.94,74.04 26.67,72.77 26.67,62.1 20.07,55.5 20.07,40.64 C7.+ | v29.34,75.56 29.34,77.72 31.75,80.14 R6.P$1
  Bottom 0.406: SW2.1 21.34,15.24 19.05,17.53 16.89,17.53 16.64,17.78 14.22,17.78 11.81,20.19 | 11.81,20.19 8.89,23.11 8.89,27.65 X1.5 9.91,27.82 13.84,31.75 13.84,34.42 C7.+ 17.4,37.85 21.34,33.91 27.3,33.91 R5.P$2 | v27.94,74.04 29.34,75.44 v29.34,75.56 | JP2.2 65.53,67.31 64.39,68.45 47.12,68.45 38.73,76.83 35.18,76.83 R6.P$1 | S1.3 16.38,20.32 11.94,20.32 11.81,20.19

### Text on the board
tPlace: FILT | DK | LDR:1234 | 1 | 2 | + | 3 | 4 | TRG/DK/FLT/STR
bPlace: The Yowler by CFOGE 2017
tStop: VOL | 9v c- | TRIG
_tsilk: OSC:3/4